# EAGLE design ADNS-9800 (EAGLE 6.3)
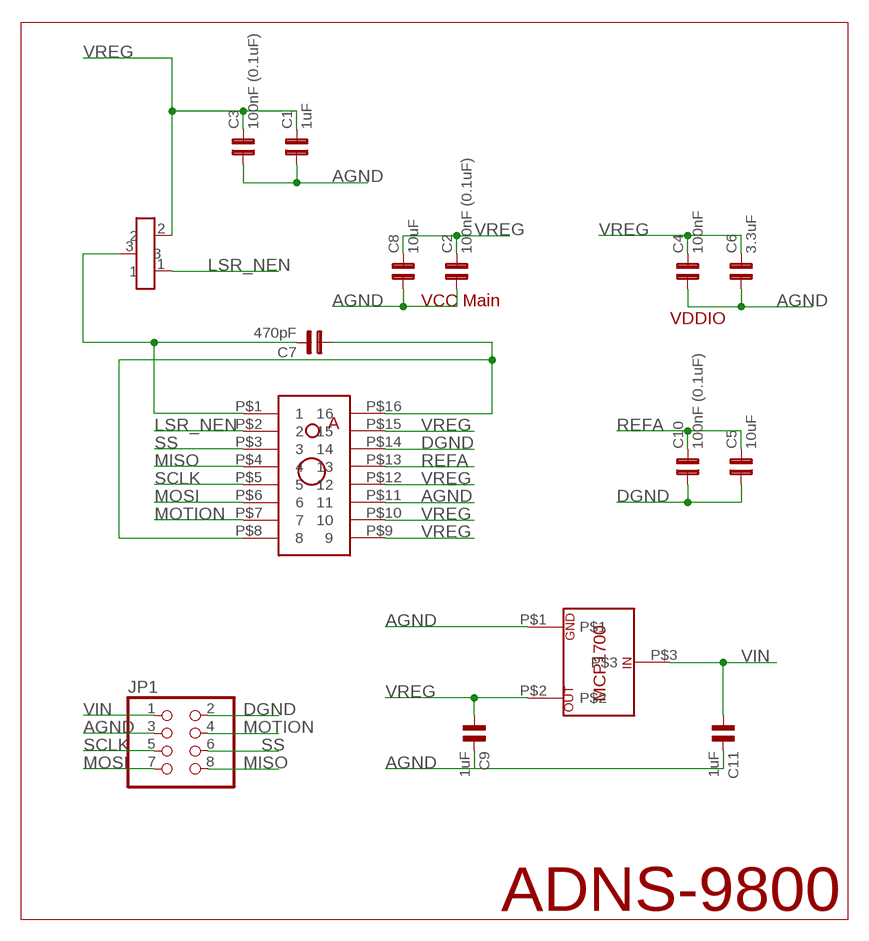
[diagram p0: schematic, sheet 1]

## Parts
C1  1uF  C0603  [0603]
C2  100nF (0.1uF)  C0603  [0603]
C3  100nF (0.1uF)  C0603  [0603]
C4  100nF  C0603  [0603]
C5  10uF  C0603  [0603]
C6  3.3uF  C0603  [0603]
C7  470pF  C0603  [0603]
C8  10uF  C0603  [0603]
C9  1uF  C0603  [0603]
C10  100nF (0.1uF)  C0603  [0603]
C11  1uF  C0603  [0603]
JP1  PINHD-2X4  [2X04]
Q1  TRANSISTOR_SC-75  [SC-75_TRANSISTOR]
U$1  AVAGO_ADNS-9500  [AVAGO_ADNS-9500]
U$2  MCP1700__LDO  [MCP1700__LDO]

## Nets
AGND: C1.1 C2.1 C3.1 C4.1 C6.1 C8.1 C9.2 C11.2 JP1.3 U$1.P$11 U$2.P$1
DGND: C5.1 C10.1 JP1.2 U$1.P$14
LSR_NEN: Q1.1 U$1.P$2
MISO: JP1.8 U$1.P$4
MOSI: JP1.7 U$1.P$6
MOTION: JP1.4 U$1.P$7
N$1: C7.1 U$1.P$8 U$1.P$16
N$2: C7.2 Q1.3 U$1.P$1
REFA: C5.2 C10.2 U$1.P$13
SCLK: JP1.5 U$1.P$5
SS: JP1.6 U$1.P$3
VIN: C11.1 JP1.1 U$2.P$3
VREG: C1.2 C2.2 C3.2 C4.2 C6.2 C8.2 C9.1 Q1.2 U$1.P$9 U$1.P$10 U$1.P$12 U$1.P$15 U$2.P$2

## Notes on the sheet
- VCC Main
- VDDIO
- ADNS-9800

## Library data of the parts
C1-C11 = capsmd:C0603
JP1 = pinhead:PINHD-2X4: PIN HEADER
Q1 = JKCustom:TRANSISTOR_SC-75: SC-75 Package
U$1 = JKCustom:AVAGO_ADNS-9500
U$2 = JKCustom:MCP1700__LDO

## Board
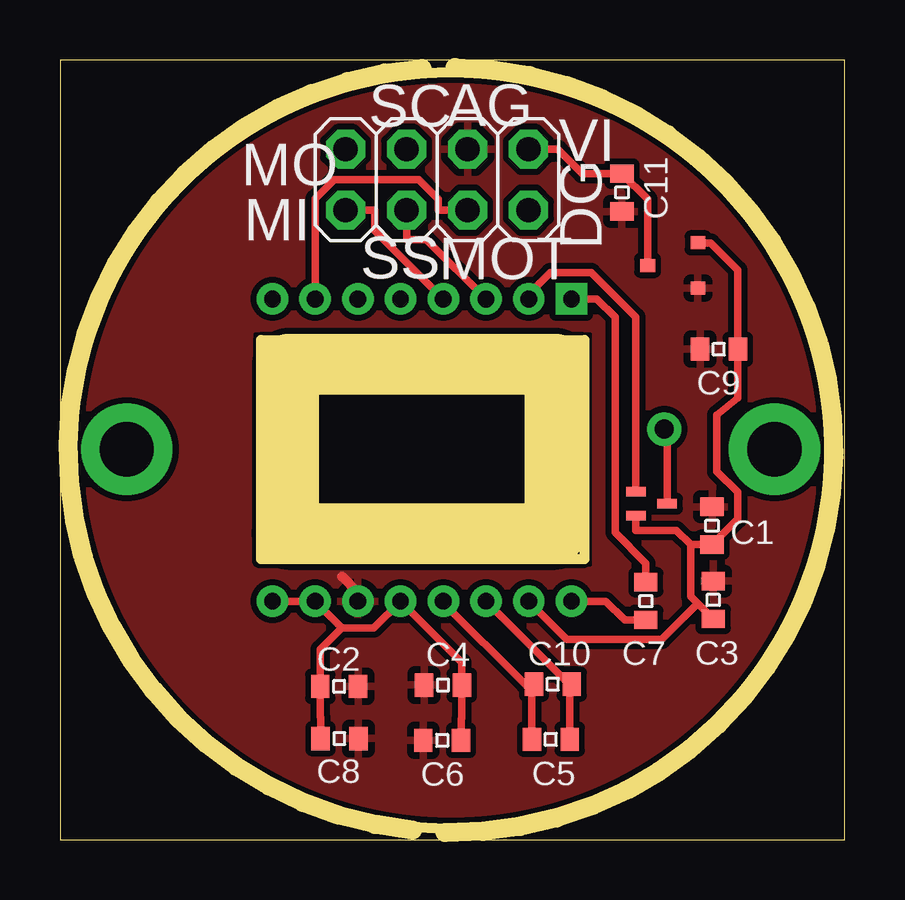
[diagram p1: board, top side]
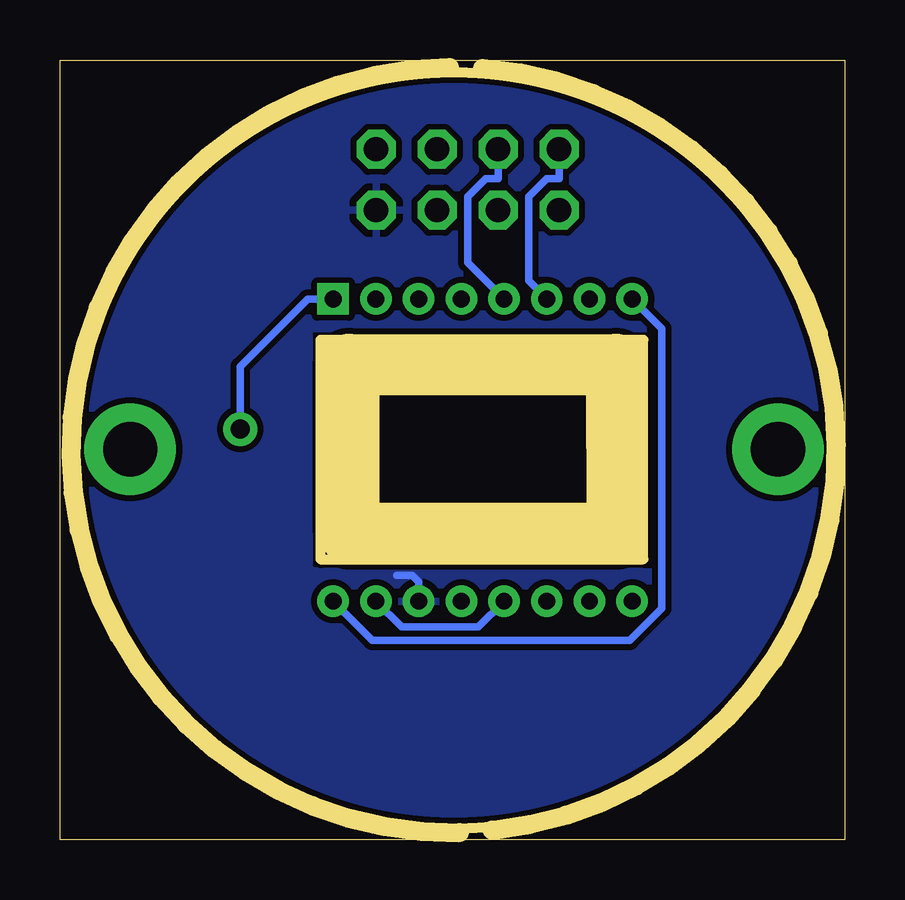
[diagram p2: board, bottom side, seen from below]

Size 32.69 x 32.5 mm. Coordinates in mm from the lower left corner, seen from the top.
Outline: 0,0 32.69,0 32.69,32.5 0,32.5 0,0
Outline: 9.52,19.81 9.5,12.76 20.63,12.76 20.64,19.81 9.52,19.81
Outline: circle at 16.29,16.23 radius 15.76
Copper layers (1*16): Top 0.035mm / dielectric 1.5mm / Bottom 0.035mm
Design rules "default *": minimum track width 12mil, minimum drill 0.7938mm, track to track 10mil, track to pad 10mil, pad to pad 10mil, via to via 10mil, smd to smd 10mil, copper to edge 10mil, drill to drill 10mil, minimum pad ring 12mil, minimum via ring 12mil, stop-mask expansion 12mil, vias tented up to drill 0mil, thermal gap 12mil
tRestrict: area 8.1,11.4 to 22.1,21.1
bRestrict: 4 lines
Milling: 6 lines

### Footprints (pad centres in the part's own frame; a part is rotated, then mirrored left to right if it is on the bottom)
0603 = smd 0.762 x 0.965: 1 -0.787,0; 2 0.787,0
2X04 = drill 1.016 octagon: 1 -3.81,-1.27; 2 -3.81,1.27; 3 -1.27,-1.27; 4 -1.27,1.27; 5 1.27,-1.27; 6 1.27,1.27; 7 3.81,-1.27; 8 3.81,1.27
SC-75_TRANSISTOR = smd 0.406 x 0.813: 1 0.2,0.4; 2 1.2,0.4; 3 0.7,1.7
AVAGO_ADNS-9500 = drill 0.7 pad 1.3 square: P$1 0,0 | drill 0.7 pad 1.3: P$2 -1.78,0; P$3 -3.56,0; P$4 -5.34,0; P$5 -7.12,0; P$6 -8.9,0; P$7 -10.68,0; P$8 -12.46,0; P$9 -12.46,-12.6; P$10 -10.68,-12.6; P$11 -8.9,-12.6; P$12 -7.12,-12.6; P$13 -5.34,-12.6; P$14 -3.56,-12.6; P$15 -1.78,-12.6; P$16 0,-12.6
MCP1700__LDO = smd 0.54 x 0.62: P$1 0,0; P$2 1.9,0; P$3 0.95,2.1

### Placement (x,y rotation side)
C1  27.17,13.09 270 top
C2  11.63,6.39 180 top
C3  27.22,9.99 270 top
C4  15.96,6.44 0 top
C5  20.45,4.18 180 top
C6  15.92,4.14 0 top
C7  24.41,9.95 90 top
C8  11.65,4.21 180 top
C9  27.46,20.44 180 top
C10  20.54,6.48 180 top
C11  23.41,26.97 270 top
JP1  15.71,27.51 180 top
Q1  23.59,14.7 270 top
U$1  21.31,22.54 0 top
U$2  26.58,22.99 90 top

### Tracks (layer width: path | path; a pad name or v marks a point on that pad's centre or on a via)
AGND
  Top 0.305: U$1.P$11 12.41,10.3
  Top 0.406: 12.41,10.3 11.75,10.96
  pour Top: 0,0 0,33.02 33.02,33.02 33.02,0
DGND
  Top 0.305: 21.24,6.48 C10.1 | U$1.P$14 21.2,6.48 21.24,6.48 | 21.24,6.48 21.24,5.07 C5.1
  Bottom 0.305: U$1.P$14 17.75,10.29 17.75,10.74 18.02,11.01 18.66,11.01 18.67,11.02
  pour Bottom: 0,0 0,33.02 33.02,33.02 33.02,0
LSR_NEN
  Top 0.305: U$1.P$2 19.53,22.74 20.43,23.65 22.14,23.65 23.99,21.79 Q1.1
MISO
  Top 0.305: JP1.8 13.12,26.24 13.12,25.39 U$1.P$4
MOSI
  Bottom 0.305: JP1.7 11.9,27.56 12.41,27.56 13.17,26.8 13.17,23.3 U$1.P$6
MOTION
  Top 0.305: JP1.4 15.76,26.24 15.76,26.7 14.95,27.51 11.42,27.51 10.63,26.72 U$1.P$7
N$1
  Top 0.305: C7.1 23.52,9.16 22.75,9.94 U$1.P$16
  Bottom 0.305: U$1.P$16 19.68,8.31 8.96,8.31 7.63,9.64 7.63,21.31 U$1.P$8
N$2  (via drill 0.79 pad 1.4)
  Top 0.305: v25.18,17.11 25.29,17 Q1.3 | C7.2 24.41,11.52 23.13,12.81 23.13,21.78 22.37,22.54 U$1.P$1
  Bottom 0.305: U$1.P$1 22.37,22.54 25.18,19.73 v25.18,17.11
N$5  (via drill 2.26 pad 3.81)
  other vias: 29.77,16.27
N$6  (via drill 2.26 pad 3.81)
  other vias: 2.78,16.27
REFA
  Top 0.305: U$1.P$13 15.97,9.87 19.36,6.48 | 19.36,6.48 19.67,6.17 C5.2 | C10.2 19.36,6.48
SCLK
  Bottom 0.305: JP1.5 14.44,27.56 14.95,27.56 15.71,26.8 15.71,24.06 U$1.P$5
SS
  Top 0.305: JP1.6 14.44,25.02 15.26,25.02 U$1.P$3
VIN
  Top 0.305: U$2.P$3 24.48,26.69 C11.1 21.76,27.76 20.74,28.78 JP1.1
VREG
  Top 0.305: 26.57,9.85 26.28,10.14 26.28,12.3 | C3.2 26.57,9.85 | 26.57,9.85 25.08,8.36 21.11,8.36 U$1.P$15 | 11.74,8.83 13.08,8.83 U$1.P$12 16.74,7.38 C4.2 16.74,5.06 16.71,5.02 C6.2 | 11.74,8.83 U$1.P$10 U$1.P$9 | 11.74,8.83 10.85,7.94 C2.2 10.85,5.11 10.86,5.1 C8.2 | 26.28,12.3 C1.2 28.24,13.37 28.24,14.5 27.36,15.34 27.36,17.69 28.24,18.4 C9.1 28.24,22.55 28.24,23.75 27.12,24.87 26.59,24.87 U$2.P$2 | Q1.2 23.99,12.89 25.68,12.89 26.28,12.3
  Bottom 0.305: U$1.P$15 18.46,8.87 15.26,8.87 U$1.P$12

### Text on the board
_tsilk: SC | AG | VI | MO | MI | DG | SS | MOT